# EAGLE design lcd-hedgehog (EAGLE 6.3)
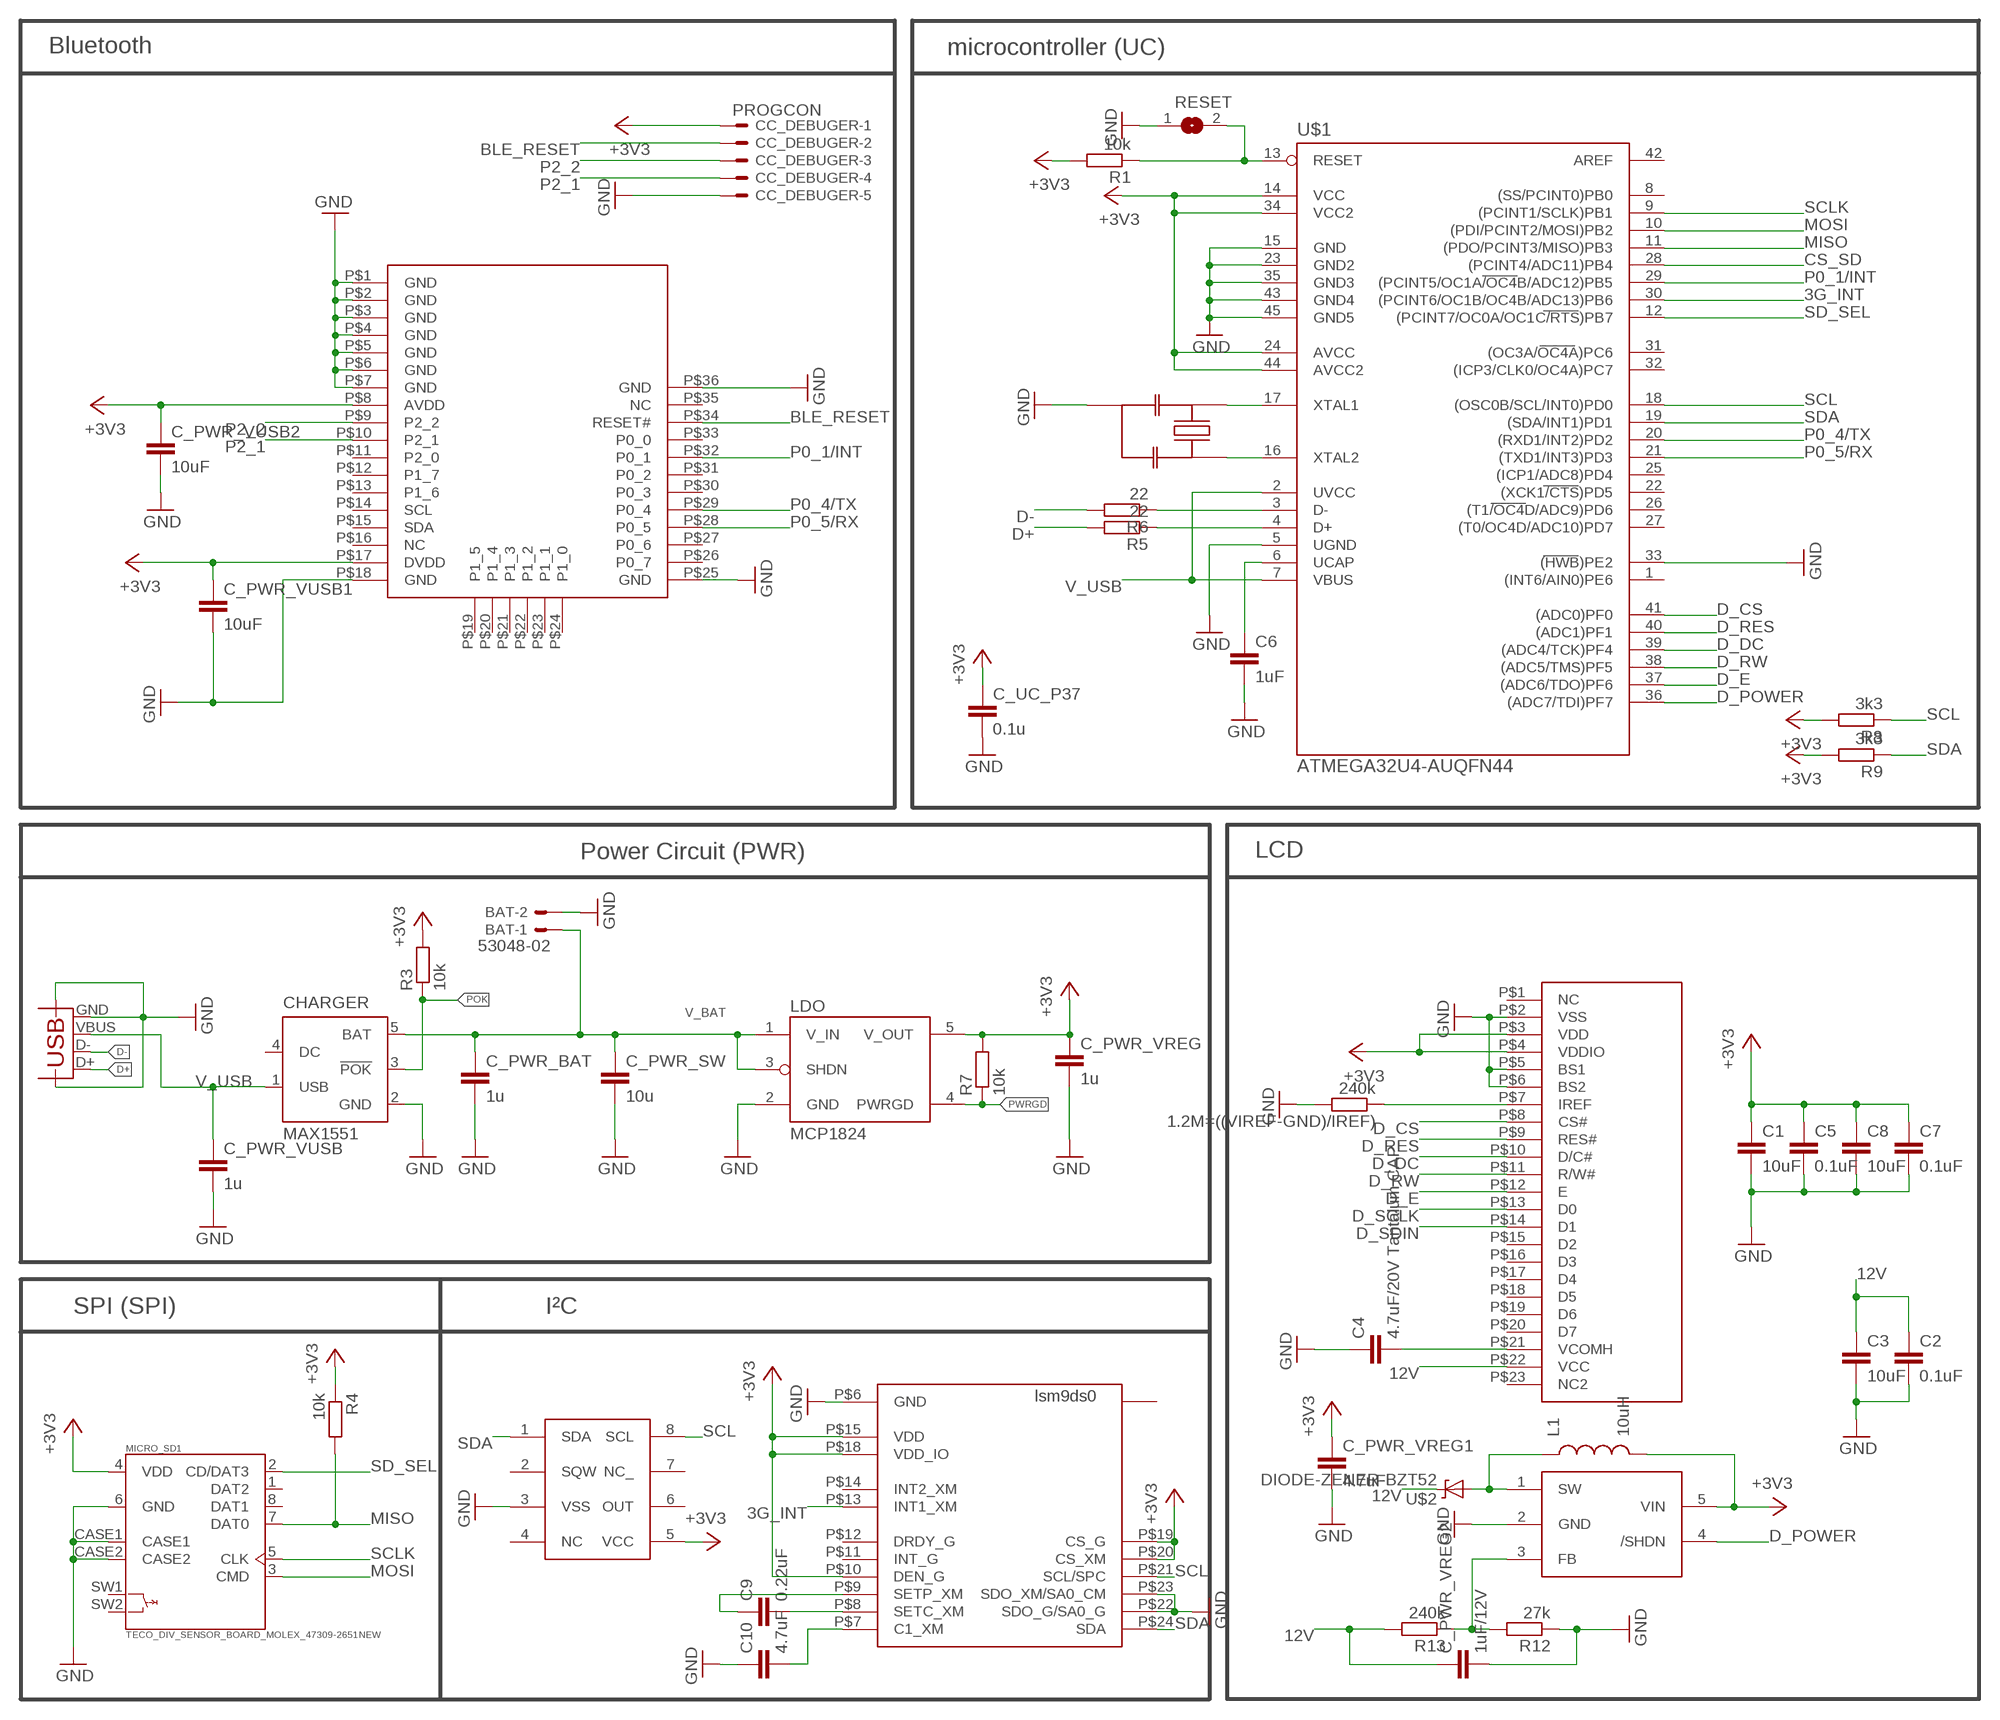
[diagram p0: schematic, sheet 1]

## Parts
1.2M=((VIREF-GND)/IREF)  240k  R-EU_R0603  [R0603]
12MHZ_RESONATOR  RESONATORPRQC-S  [PRQC]
BAT  53048-02  [53048-02]
C1  10uF  C-EUC0603K  [C0603K]
C2  0.1uF  C-EUC0603K  [C0603K]
C3  10uF  C-EUC0603K  [C0603K]
C4  4.7uF/20V Tantalum CAP  C-EUC0603K  [C0603K]
C5  0.1uF  C-EUC0603K  [C0603K]
C6  1uF  C-EUC0603K  [C0603K]
C7  0.1uF  C-EUC0603K  [C0603K]
C8  10uF  C-EUC0603K  [C0603K]
C9  0.22uF  C-EUC0603K  [C0603K]
C10  4.7uF  C-EUC0603K  [C0603K]
C_PWR_BAT  1u  C-EUC0603K  [C0603K]
C_PWR_SW  10u  C-EUC0805K  [C0805K]
C_PWR_VREG  1u  C-EUC0603K  [C0603K]
C_PWR_VREG1  4.7uF  C-EUC0603K  [C0603K]
C_PWR_VREG2  1uF/12V  C-EUC0603K  [C0603K]
C_PWR_VUSB  1u  C-EUC0603K  [C0603K]
C_PWR_VUSB1  10uF  C-EUC0603K  [C0603K]
C_PWR_VUSB2  10uF  C-EUC0603K  [C0603K]
C_UC_P37  0.1u  C-EUC0603K  [C0603K]
CC_DEBUGER  PROGCON  [53047-05-OCT]
CHARGER  MAX1551  [SOT23-5L]
L1  10uH  SPARKFUN_INDUCTOR0603  [SPARKFUN_0603]
LDO  MCP1824  [SOT-23-5]
MICRO_SD1  TECO_DIV_SENSOR_BOARD_MOLEX_47309-2651NEW  [TECO_DIV_SENSOR_BOARD_MOLEX_47309-2651]
R1  10k  R-EU_R0603  [R0603]
R3  10k  R-EU_R0603  [R0603]
R4  10k  R-EU_R0603  [R0603]
R5  22  R-EU_R0603  [R0603]
R6  22  R-EU_R0603  [R0603]
R7  10k  R-EU_R0603  [R0603]
R8  3k3  R-EU_R0603  [R0603]
R9  3k3  R-EU_R0603  [R0603]
R12  27k  R-EU_R0603  [R0603]
R13  240k  R-EU_R0603  [R0603]
RESET  SJ  [SJ]
U$1  ATMEGA32U4-AUQFN44  [QFN44]
U$2  DIODE-ZENER-BZT52  [SOD-323]
U$3  STUFF_M41T62  [STUFF_M41T62LC6F]
U$4  SFV23  [SFV23]
U$5  LM2703  [SOT-23-5]
U$6  BLE113-A  [BLE113-A]
U$7  LSM9D  [LGA4X4]
X1  SPARKFUN_USB-MICROB  [SPARKFUN_USB-MICROB]

## Nets
3G_INT: U$1.30((PCINT6/OC1B/OC4B/ADC13)PB6) U$7.P$13(INT1_XM)
12V: C2.1 C3.1 C_PWR_VREG2.1 R13.2 U$2.1(C) U$4.P$22(VCC)
+3V3: C1.1 C5.1 C7.1 C8.1 C_PWR_VREG1.1 C_PWR_VREG.1 C_PWR_VUSB1.1 C_PWR_VUSB2.1 C_UC_P37.1 CC_DEBUGER.1 L1.2 LDO.5(V_OUT) MICRO_SD1.4(VDD) R1.2 R3.2 R4.1 R7.2 R8.2 R9.2 U$1.14(VCC) U$1.24(AVCC) U$1.34(VCC2) U$1.44(AVCC2) U$3.5(VCC) U$4.P$3(VDD) U$4.P$4(VDDIO) U$5.5(VIN) U$6.P$8(AVDD) U$6.P$17(DVDD) U$7.P$10(DEN_G) U$7.P$15(VDD) U$7.P$18(VDD_IO) U$7.P$19(CS_G) U$7.P$20(CS_XM)
BLE_RESET: CC_DEBUGER.2 U$6.P$34(RESET#)
CS_SD: U$1.28((PCINT4/ADC11)PB4)
D+: R5.2 X1.D+
D-: R6.2 X1.D-
D_CS: U$1.41((ADC0)PF0) U$4.P$8(CS#)
D_DC: U$1.39((ADC4/TCK)PF4) U$4.P$10(D/C#)
D_E: U$1.37((ADC6/TDO)PF6) U$4.P$12(E)
D_POWER: U$1.36((ADC7/TDI)PF7) U$5.4(/SHDN)
D_RES: U$1.40((ADC1)PF1) U$4.P$9(RES#)
D_RW: U$1.38((ADC5/TMS)PF5) U$4.P$11(R/W#)
D_SCLK: U$4.P$13(D0)
D_SDIN: U$4.P$14(D1)
GND: 1.2M=((VIREF-GND)/IREF).2 12MHZ_RESONATOR.GND BAT.2 C1.2 C2.2 C3.2 C4.1 C5.2 C6.2 C7.2 C8.2 C10.1 C_PWR_BAT.2 C_PWR_SW.2 C_PWR_VREG1.2 C_PWR_VREG2.2 C_PWR_VREG.2 C_PWR_VUSB1.2 C_PWR_VUSB2.2 C_PWR_VUSB.2 C_UC_P37.2 CC_DEBUGER.5 CHARGER.2(GND) LDO.2(GND) MICRO_SD1.6(GND) MICRO_SD1.CASE1 MICRO_SD1.CASE2 R12.1 RESET.1 U$1.5(UGND) U$1.15(GND) U$1.23(GND2) U$1.33((HWB)PE2) U$1.35(GND3) U$1.43(GND4) U$1.45(GND5) U$3.3(VSS) U$4.P$2(VSS) U$4.P$5(BS1) U$4.P$6(BS2) U$5.2(GND) U$6.P$1(GND) U$6.P$2(GND) U$6.P$3(GND) U$6.P$4(GND) U$6.P$5(GND) U$6.P$6(GND) U$6.P$7(GND) U$6.P$18(GND) U$6.P$25(GND) U$6.P$36(GND) U$7.P$5(GND) U$7.P$22(SDO_G/SA0_G) U$7.P$23(SDO_XM/SA0_CM) X1.GND X1.GND@2(CASE) X1.GND@3(CASE)
MISO: MICRO_SD1.7(DAT0) R4.2 U$1.11((PDO/PCINT3/MISO)PB3)
MOSI: MICRO_SD1.3(CMD) U$1.10((PDI/PCINT2/MOSI)PB2)
N$1: R1.1 RESET.2 U$1.13(RESET)
N$2: 12MHZ_RESONATOR.2 U$1.17(XTAL1)
N$3: 12MHZ_RESONATOR.1 U$1.16(XTAL2)
N$5: R6.1 U$1.3(D-)
N$6: R5.1 U$1.4(D+)
N$7: C9.2 U$7.P$8(SETC_XM)
N$8: C9.1 U$7.P$9(SETP_XM)
N$9: C10.2 U$7.P$7(C1_XM)
N$11: C6.1 U$1.6(UCAP)
N$15: R12.2 R13.1 U$5.3(FB)
N$16: L1.1 U$2.2(A) U$5.1(SW)
N$22: C4.2 U$4.P$21(VCOMH)
N$23: 1.2M=((VIREF-GND)/IREF).1 U$4.P$7(IREF)
P0_1/INT: U$1.29((PCINT5/OC1A/OC4B/ADC12)PB5) U$6.P$32(P0_1)
P0_4/TX: U$1.20((RXD1/INT2)PD2) U$6.P$29(P0_4)
P0_5/RX: U$1.21((TXD1/INT3)PD3) U$6.P$28(P0_5)
P2_1: CC_DEBUGER.4 U$6.P$10(P2_1)
P2_2: CC_DEBUGER.3 U$6.P$9(P2_2)
POK: CHARGER.3(!POK) R3.1
PWRGD: LDO.4(PWRGD) R7.1
SCL: R8.1 U$1.18((OSC0B/SCL/INT0)PD0) U$3.8(SCL) U$7.P$21(SCL/SPC)
SCLK: MICRO_SD1.5(CLK) U$1.9((PCINT1/SCLK)PB1)
SD_SEL: MICRO_SD1.2(CD/DAT3) U$1.12((PCINT7/OC0A/OC1C/RTS)PB7)
SDA: R9.1 U$1.19((SDA/INT1)PD1) U$3.1(SDA) U$7.P$24(SDA)
V_BAT: BAT.1 C_PWR_BAT.1 C_PWR_SW.1 CHARGER.5(BAT) LDO.1(V_IN) LDO.3(SHDN)
V_USB: C_PWR_VUSB.1 CHARGER.1(USB) U$1.2(UVCC) U$1.7(VBUS) X1.VBUS
Unconnected: CHARGER.4(DC) MICRO_SD1.1(DAT2) MICRO_SD1.8(DAT1) MICRO_SD1.SW1 MICRO_SD1.SW2 U$1.1((INT6/AIN0)PE6) U$1.8((SS/PCINT0)PB0) U$1.22((XCK1/CTS)PD5) U$1.25((ICP1/ADC8)PD4) U$1.26((T1/OC4D/ADC9)PD6) U$1.27((T0/OC4D/ADC10)PD7) U$1.31((OC3A/OC4A)PC6) U$1.32((ICP3/CLK0/OC4A)PC7) U$1.42(AREF) U$3.2(SQW) U$3.4(NC) U$3.6(OUT) U$3.7(NC_) U$4.P$1(NC) U$4.P$15(D2) U$4.P$16(D3) U$4.P$17(D4) U$4.P$18(D5) U$4.P$19(D6) U$4.P$20(D7) U$4.P$23(NC2) U$6.P$11(P2_0) U$6.P$12(P1_7) U$6.P$13(P1_6) U$6.P$14(SCL) U$6.P$15(SDA) U$6.P$16(NC) U$6.P$19(P1_5) U$6.P$20(P1_4) U$6.P$21(P1_3) U$6.P$22(P1_2) U$6.P$23(P1_1) U$6.P$24(P1_0) U$6.P$26(P0_7) U$6.P$27(P0_6) U$6.P$30(P0_3) U$6.P$31(P0_2) U$6.P$33(P0_0) U$6.P$35(NC) U$7.P$1(RES) U$7.P$2(RES) U$7.P$3(RES) U$7.P$4(RES) U$7.P$6(GND) U$7.P$11(INT_G) U$7.P$12(DRDY_G) U$7.P$14(INT2_XM) U$7.P$16(VDD) U$7.P$17(VDD)

## Notes on the sheet
- Bluetooth | microcontroller (UC)
- Power Circuit (PWR) | LCD
- SPI (SPI) | I²C

## Library data of the parts
1.2M=((VIREF-GND)/IREF) R1 R3-R9 R12 R13 = rcl:R-EU_: RESISTOR, European symbol
12MHZ_RESONATOR = jnode:RESONATOR: Ceramic Resonator with caps AWSCR-16.00CV-T: 16Mhz ceramic resonator with 22pF capacitors PRQC16.00SR5010X000: 16Mhz ceramic resonator with 10pF capacitors; DIGIKEY: http://www.digikey.com/product-detail/en/PRQC12.00CR5010X000/478-6318-1-ND/2506334
BAT = con-molex:53?-02: CONNECTOR wire to board 1.25 mm (.049 inch) pitch header; MF: MOLEX; MPN: 53048-0210; OC_FARNELL: 1012259; OC_NEWARK: 57H4718
C1-C10 C_PWR_BAT C_PWR_SW C_PWR_VREG C_PWR_VREG1 C_PWR_VREG2 C_PWR_VUSB C_PWR_VUSB1 C_PWR_VUSB2 C_UC_P37 = rcl:C-EU: CAPACITOR, European symbol
CC_DEBUGER = HedgehogLib:PROGCON: Programmer Connector wire to board 1.25 mm (.049 inch) pitch header
CHARGER = maxim:MAX1551: Dual-Input USB/AC Adapter 1-Cell Li+ Battery Chargers Source: http://www.maxim-ic.com .. MAX1551-MAX1555.pdf; MF: MAXIM; MPN: MAX1551EZK-T; OC_FARNELL: 1628221; OC_NEWARK: 88H0599
L1 = jnode:SPARKFUN_INDUCTOR: Inductors Basic Inductor/Choke - 0603 and 1206. Footprints are not proven and vary greatly between part numbers.
LDO = HedgehogLib:MCP1824: MCP1824T-3302E/OT http://de.farnell.com/1578387
MICRO_SD1 = jnode_v32:TECO_DIV_SENSOR_BOARD_MOLEX_47309-2651
RESET = jumper:SJ: SMD solder JUMPER
U$1 = jnode:ATMEGA32U4-AU
U$2 = SparkFun-DiscreteSemi:DIODE-ZENER: Zener Diode Production Part - 8199 3.4V Zener Voltage
U$3 = lighter:STUFF_M41T62
U$4 = HedgehogLib:SFV23
U$5 = HedgehogLib:LM2703
U$6 = jnode:BLE113-A
U$7 = jnode:LSM9D
X1 = jnode_v32:SPARKFUN_USB: USB Connectors USB-B-PTH is fully proven SKU : PRT-00139 USB-miniB is fully proven SKU : PRT-00587 USB-A-PCB is untested. USB-A-H is throughly reviewed, but untested. Spark Fun Electronics SKU : PRT-00437 USB-B-SMT is throughly reviewed, but untested. Needs silkscreen touching up. USB-A-S has not been used/tested USB-MB-H has not been used/tested

## Board
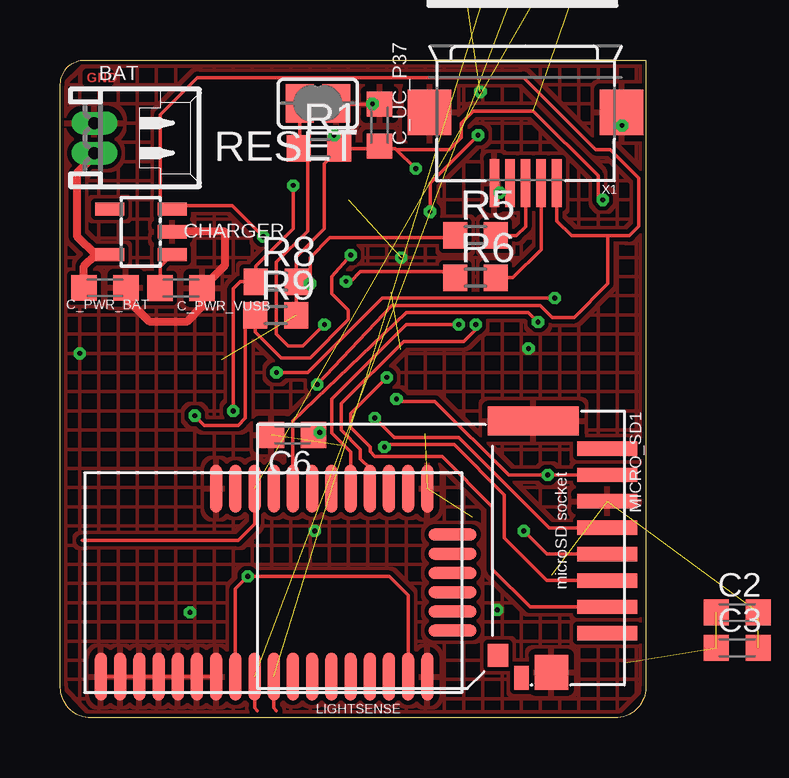
[diagram p1: board, top side]
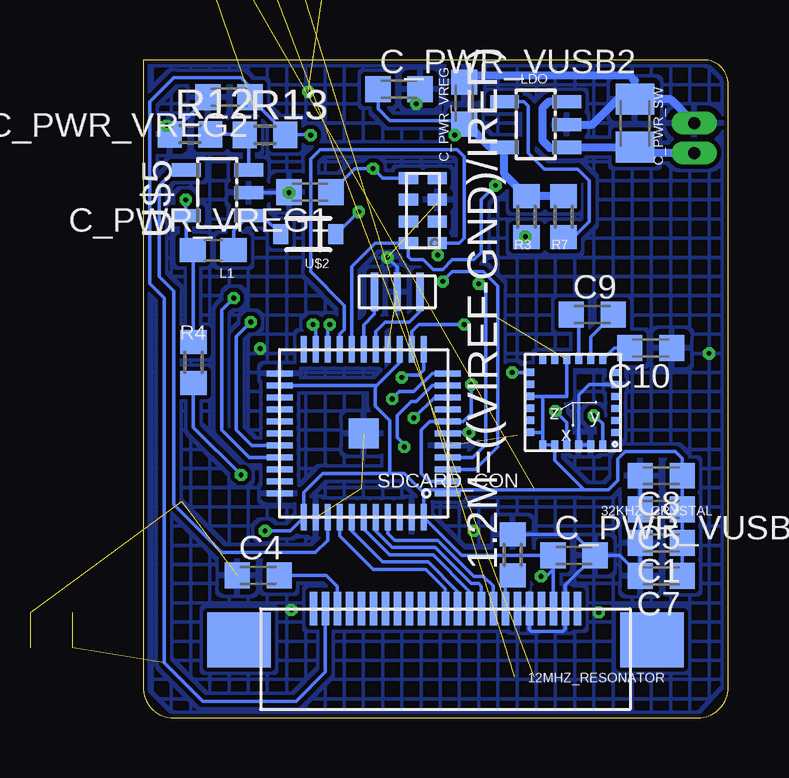
[diagram p2: board, bottom side, seen from below]

Size 24.38 x 27.43 mm. Coordinates in mm from the lower left corner, seen from the top.
Outline: 1.27,0 arc-90 0,1.27 0,26.42 arc-90 1.02,27.43 24.38,27.43 24.38,1.27 arc-90 23.11,0 1.27,0
Copper layers (1*16): Top 0.035mm / dielectric 1.5mm / Bottom 0.035mm
Design rules "default": minimum track width 6mil, minimum drill 12mil, track to track 7mil, track to pad 7mil, pad to pad 7mil, via to via 7mil, smd to smd 7mil, copper to edge 6mil, drill to drill 6mil, minimum pad ring 9mil, minimum via ring 6mil, stop-mask expansion 4mil, vias tented up to drill 0mil, thermal gap 10mil

### Footprints (pad centres in the part's own frame; a part is rotated, then mirrored left to right if it is on the bottom)
R0603 = smd 1 x 1.1: 1 -0.85,0; 2 0.85,0
PRQC = smd 0.3 x 1.6: 1 -0.95,0; 2 0.95,0; GND 0,0
53048-02 = drill 0.5 pad 0.698 long: 1 0.625,-1.25; 2 -0.625,-1.25
C0603K = smd 1.05 x 1.08: 1 -0.875,0; 2 0.875,0
C0805K = smd 1.3 x 1.6: 1 -1,0; 2 1,0
53047-05-OCT = drill 0.5 pad 0.889 octagon: 1 2.5,0; 2 1.25,0; 3 0,0; 4 -1.25,0; 5 -2.5,0
SOT23-5L = smd 0.55 x 1.2: 1 -0.95,-1.3; 2 0,-1.3; 3 0.95,-1.3; 4 0.95,1.3; 5 -0.95,1.3
SPARKFUN_0603 = smd 1.1 x 1: 1 -0.85,0; 2 0.85,0
SOT-23-5 = smd 0.55 x 1.2: 1 -0.95,-1.3; 2 0,-1.3; 3 0.95,-1.3; 4 0.95,1.3; 5 -0.95,1.3
TECO_DIV_SENSOR_BOARD_MOLEX_47309-2651 = smd 0.6 x 2.5: 1 3.43,2.385; 2 2.33,2.385; 3 1.23,2.385; 4 0.13,2.385; 5 -0.97,2.385; 6 -2.07,2.385; 7 -3.17,2.385; 8 -4.27,2.385 | smd 1.2 x 3.79: CASE1 -5.42,-0.695 | smd 1.45 x 1.4: CASE2 5.055,0.06 | smd 1 x 0.6: SW1 5.28,-1.19 | smd 0.95 x 0.85: SW2 4.355,-2.165
SJ = smd 1.168 x 1.6: 1 -0.762,0; 2 0.762,0
QFN44 = smd 1.1 x 0.25: 1 -3.5,2.5; 2 -3.5,2; 3 -3.5,1.5; 4 -3.5,1; 5 -3.5,0.5; 6 -3.5,0; 7 -3.5,-0.5; 8 -3.5,-1; 9 -3.5,-1.5; 10 -3.5,-2; 11 -3.5,-2.5; 23 3.5,-2.5; 24 3.5,-2; 25 3.5,-1.5; 26 3.5,-1; 27 3.5,-0.5; 28 3.5,0; 29 3.5,0.5; 30 3.5,1; 31 3.5,1.5; 32 3.5,2; 33 3.5,2.5 | smd 0.25 x 1.1: 12 -2.5,-3.5; 13 -2,-3.5; 14 -1.5,-3.5; 15 -1,-3.5; 16 -0.5,-3.5; 17 0,-3.5; 18 0.5,-3.5; 19 1,-3.5; 20 1.5,-3.5; 21 2,-3.5; 22 2.5,-3.5; 34 2.5,3.5; 35 2,3.5; 36 1.5,3.5; 37 1,3.5; 38 0.5,3.5; 39 0,3.5; 40 -0.5,3.5; 41 -1,3.5; 42 -1.5,3.5; 43 -2,3.5; 44 -2.5,3.5 | smd 1.25 x 1.25: 45 0,0
SOD-323 = smd 0.63 x 0.83: 1 -1.15,0; 2 1.15,0
STUFF_M41T62LC6F = smd 0.5 x 0.8: 1 -0.9,-0.6; 2 0,-0.6; 3 0.9,-0.6; 4 1.8,-0.6; 5 1.8,0.6; 6 0.9,0.6; 7 0,0.6; 8 -0.9,0.6
SFV23 = smd 0.3 x 1.4: P$1 5.5,1; P$2 5,1; P$3 4.5,1; P$4 4,1; P$5 3.5,1; P$6 3,1; P$7 2.5,1; P$8 2,1; P$9 1.5,1; P$10 1,1; P$11 0.5,1; P$12 0,1; P$13 -0.5,1; P$14 -1,1; P$15 -1.5,1; P$16 -2,1; P$17 -2.5,1; P$18 -3,1; P$19 -3.5,1; P$20 -4,1; P$21 -4.5,1; P$22 -5,1; P$23 -5.5,1 | smd 2.65 x 2.3: P$24 -8.6,-0.3; P$25 8.6,-0.3
BLE113-A = smd 2 x 0.5: P$1 0.65,15.05; P$2 0.65,14.25; P$3 0.65,13.45; P$4 0.65,12.65; P$5 0.65,11.85; P$6 0.65,11.05; P$7 0.65,10.25; P$8 0.65,9.45; P$9 0.65,8.65; P$10 0.65,7.85; P$11 0.65,7.05; P$12 0.65,6.25; P$13 0.65,5.45; P$14 0.65,4.65; P$15 0.65,3.85; P$16 0.65,3.05; P$17 0.65,2.25; P$18 0.65,1.45; P$25 8.5,1.45; P$26 8.5,2.25; P$27 8.5,3.05; P$28 8.5,3.85; P$29 8.5,4.65; P$30 8.5,5.45; P$31 8.5,6.25; P$32 8.5,7.05; P$33 8.5,7.85; P$34 8.5,8.65; P$35 8.5,9.45; P$36 8.5,10.25 | smd 0.5 x 2: P$19 2.575,0.4; P$20 3.375,0.4; P$21 4.175,0.4; P$22 4.975,0.4; P$23 5.775,0.4; P$24 6.575,0.4
LGA4X4 = smd 0.35 x 0.3: P$1 -1.775,1.255; P$2 -1.775,0.755; P$3 -1.775,0.255; P$4 -1.775,-0.245; P$5 -1.775,-0.745; P$6 -1.775,-1.245; P$13 1.775,-1.25; P$14 1.775,-0.75; P$15 1.775,-0.25; P$16 1.775,0.25; P$17 1.775,0.75; P$18 1.775,1.25 | smd 0.3 x 0.35: P$7 -1.25,-1.775; P$8 -0.75,-1.775; P$9 -0.25,-1.775; P$10 0.25,-1.775; P$11 0.75,-1.775; P$12 1.25,-1.775; P$19 1.25,1.775; P$20 0.75,1.775; P$21 0.25,1.775; P$22 -0.25,1.775; P$23 -0.75,1.775; P$24 -1.25,1.775
SPARKFUN_USB-MICROB = smd 0.4 x 2: D+ 0,3.1; D- -0.65,3.1; GND 1.3,3.1; ID 0.65,3.1; VBUS -1.3,3.1 | smd 1.8 x 1.9: GND@2 -4,0.15; GND@3 4,0.15

### Placement (x,y rotation side)
1.2M=((VIREF-GND)/IREF)  8.98,6.8 90 bottom
12MHZ_RESONATOR  13.79,17.76 180 bottom
BAT  2.67,24.18 270 top
C1  2.79,7.3 180 bottom
C2  28.19,4.39 0 top
C3  28.19,2.92 0 top
C4  19.58,5.94 0 bottom
C5  2.79,8.7 180 bottom
C6  9.67,11.8 180 top
C7  2.79,5.92 180 bottom
C8  2.79,10.1 180 bottom
C9  5.66,16.81 0 bottom
C10  3.23,15.42 180 bottom
C_PWR_BAT  1.85,17.93 0 top
C_PWR_SW  3.89,24.79 90 bottom
C_PWR_VREG  11,25.63 90 bottom
C_PWR_VREG1  17.42,21.92 180 bottom
C_PWR_VREG2  20.8,25.88 180 bottom
C_PWR_VUSB  5.02,17.93 0 top
C_PWR_VUSB1  6.42,6.78 0 bottom
C_PWR_VUSB2  13.72,26.21 0 bottom
C_UC_P37  13.29,24.71 90 top
CC_DEBUGER  19.25,31.21 0 top  (outside the outline)
CHARGER  3.35,20.27 90 top
L1  21.46,19.51 180 bottom
LDO  8.03,24.74 90 bottom
MICRO_SD1  20.4,6.96 270 top
R1  10.78,23.74 0 top
R3  8.41,20.9 90 bottom
R4  22.28,14.82 270 bottom
R5  17.3,20.13 0 top
R6  17.3,18.35 0 top
R7  6.86,20.9 90 bottom
R8  8.99,18.19 0 top
R9  8.97,16.79 0 top
R12  22.43,24.33 0 bottom
R13  19.3,24.31 0 bottom
RESET  10.73,25.62 180 top
U$1  15.19,11.86 180 bottom
U$2  17.5,20.17 180 bottom
U$3  12.73,20.7 90 bottom
U$4  11.79,3.56 0 bottom
U$5  21.29,21.89 90 bottom
U$6  16.74,1.07 90 top
U$7  6.48,13.16 180 bottom
X1  19.38,25.4 180 top

### Tracks (layer width: path | path; a pad name or v marks a point on that pad's centre or on a via)
3G_INT  (via drill 0.2)
  Top 0.15: v20.6,17.5 13.4,17.5 10.3,14.4 v9,14.4
  Bottom 0.15: U$1.30 19.96,10.86 21.1,12 21.1,17 v20.6,17.5 | v9,14.4 U$7.P$13
12V  (via drill 0.2)  (2 unrouted)
  Top 0.15: v17.4,24.3 15.4,22.3 v15.4,21.1
  Bottom 0.15: v17.4,24.3 v17.41,24.31 R13.2 18.45,24.41 C_PWR_VREG2.1 19.93,26.33 20.3,26.7 23.1,26.7 24.1,25.7 24.1,18.1 23.5,17.5 23.5,2.3 21.9,0.7 18,0.7 16.79,1.91 U$4.P$22 | v15.4,21.1 16.33,20.17 U$2.1
+3V3  (via drill 0.2)  (2 unrouted)
  Top 0.15: C_UC_P37.1 13.2,23.74 | 13.2,23.74 R1.2 | R8.2 9.82,18.19 | 9.82,18.19 R9.2 | R1.2 11.63,24.07 v11.4,24.3 | 13.2,23.74 13.96,23.74 14,23.7 | 14,23.7 v14.8,22.9 | 9.82,18.19 9.82,19.22 11,20.4 11,23.12 R1.2 | v22.6,21.6 22.4,21.6 22.4,22.6 19.7,25.3 17.2,25.3 16.7,24.8 16.7,24.2 16.2,23.7 14,23.7 | U$6.P$17 14.49,5.11 13.7,5.9 v7.8,5.9 7.29,5.39 U$6.P$8 | MICRO_SD1.4 20.27,6.83 v19.3,7.8
  Bottom 0.15: U$7.P$18 7.73,11.91 | 7.73,11.91 U$7.P$19 U$7.P$20 7.23,10.73 6,9.5 | U$7.P$15 7.73,13.41 | 7.73,13.41 7.73,11.91 | U$7.P$10 6.73,13.41 7.73,13.41 | U$1.44 11.11,6.78 C_PWR_VUSB1.1 7.29,6.76 7.29,6.2 | U$4.P$4 U$4.P$3 7.29,6.2 | C7.1 C1.1 C5.1 C8.1 1.92,10.82 2.2,11.1 4.3,11.1 4.6,10.8 4.6,9.9 5,9.5 6,9.5 | U$1.14 13.69,14.81 14.64,13.86 14.7,13.86 | 14.7,13.86 U$1.24 | U$1.44 12.69,9.39 13.5,10.2 14.1,10.2 | 14.1,10.2 16.9,10.2 17.69,9.41 U$1.34 18.25,7.8 v19.3,7.8 | 6,9.5 12.69,9.5 U$1.44 | 14.1,10.2 14.1,12.4 14.7,13 14.7,13.86 | v11.4,24.3 11.4,24.35 C_PWR_VREG.1 11.14,24.9 14.1,24.9 14.59,25.39 C_PWR_VUSB2.1 | U$3.5 14.4,22.5 v14.8,22.9 15.57,22.9 C_PWR_VREG1.1 | R4.1 22.28,19.48 L1.2 22.59,19.78 U$5.5 22.6,20.96 v22.6,21.6 | v7.8,5.9 7.59,5.9 7.29,6.2
  Bottom 0.33: C_PWR_VREG.1 10.88,24.75 9.93,23.8 9.68,23.79 LDO.5 9.33,22.67 R3.2 R7.2
BLE_RESET  (1 unrouted)
  Top 0.15: U$6.P$34 8.09,8.09 7.4,7.4 0.9,7.4
D+
  Top 0.15: X1.D+ 19.38,20.48 19,20.1 18.17,20.1 R5.2
D-
  Top 0.15: X1.D- 20.03,19.53 18.85,18.35 R6.2
D_CS
  Bottom 0.15: U$1.41 14.19,7.69 13.9,7.4 12.1,7.4 10.6,5.9 10.2,5.9 9.8,5.5 U$4.P$8
D_DC
  Bottom 0.15: U$4.P$10 10.79,5.29 12.3,6.8 14.1,6.8 15.19,7.89 U$1.39
D_E
  Bottom 0.15: U$1.37 16.19,7.59 14.8,6.2 12.6,6.2 11.79,5.39 U$4.P$12
D_POWER
  Bottom 0.15: U$1.36 16.69,7.41 17.2,6.9 21.1,6.9 23.1,8.9 23.1,17.8 23.7,18.4 23.7,22.2 23.05,22.84 U$5.4
D_RES
  Bottom 0.15: U$4.P$9 10.29,5.49 10.4,5.6 10.7,5.6 12.2,7.1 14,7.1 14.69,7.79 U$1.40
D_RW
  Bottom 0.15: U$1.38 15.69,7.79 14.4,6.5 12.5,6.5 11.29,5.29 U$4.P$11
GND  (via drill 0.2)  (9 unrouted)
  Top 0.15: RESET.1 11.53,25.58 C_UC_P37.2 | U$6.P$7 U$6.P$6 U$6.P$5 U$6.P$4 U$6.P$3 U$6.P$2 U$6.P$1 | 23.28,25.15 X1.GND@2 23.38,24.72 v23.4,24.7 | v18.3,21.9 18.08,22.12 X1.GND | v14.2,19.2 14.3,19.2
  Top 0.33: CHARGER.2 6.86,20.27 6.86,18.89 C_PWR_VUSB.2 5.92,18.03 5.92,17.17 5.28,16.53 3.71,16.53 2.73,17.51 C_PWR_BAT.2
  Bottom 0.15: U$4.P$6 U$4.P$5 8.29,3.69 8.2,3.6 6.9,3.6 6.79,3.71 U$4.P$2 6.79,5.54 C_PWR_VUSB1.2 | C_PWR_VREG2.2 23.23,24.33 R12.1 23.4,24.45 v23.4,24.7 | C_PWR_VREG1.2 18.32,21.89 U$5.2 | C8.2 C5.2 C1.2 C7.2 4.53,6.78 C_PWR_VUSB1.2 | 1.2M=((VIREF-GND)/IREF).2 6.42,7.64 C_PWR_VUSB1.2 | U$7.P$23 U$7.P$22 6.23,13.47 5.8,13.9 U$7.P$5 | C_PWR_VUSB2.2 12.83,26.2 12.8,26.2 13,26 v13,25.6 | 12MHZ_RESONATOR.GND 13.79,18.79 v14.2,19.2 | U$3.3 12,21.6
  Bottom 0.33: 3.9,26.09 C_PWR_SW.2 | C_PWR_SW.2 3.77,26.01 | BAT.2 2.4,25.79 C_PWR_SW.2 | C_PWR_VREG.2 11.12,26.58 11.33,26.78 | LDO.2 5.66,24.74 4.62,25.78 3.62,25.78 C_PWR_SW.2 | 11,26.57 C_PWR_VREG.2 | C_PWR_SW.2 3.89,26.57 4.09,26.77 10.73,26.77 C_PWR_VREG.2
  other vias: 5.4,4.4 10.6,7.8 0.8,15.2 19.5,15.4 17.5,26.1 18.2,4.5
  pour Top (hatched): 0.1,1.3 1.2,0.1 23.2,0.1 24.2,1.1 24.2,27.2 0.9,27.2 0.1,26.4
  pour Bottom (hatched): 0.1,1.4 1.2,0.2 23.2,0.2 24.2,1.2 24.2,27.3 0.9,27.3 0.1,26.5
MISO  (via drill 0.2)
  Top 0.15: MICRO_SD1.7 v20.3,10.13 18.67,10.13 15.6,13.2 14.1,13.2 v14,13.3
  Bottom 0.15: v14,13.3 13.7,13.6 13.1,13.6 12.34,14.36 U$1.11 | R4.2 22.28,12.11 v20.3,10.13
MOSI  (via drill 0.2)
  Top 0.15: MICRO_SD1.3 20.27,5.73 18.5,7.5 18.5,9.3 16.4,11.4 13.6,11.4 v13.5,11.3
  Bottom 0.15: v13.5,11.3 13.5,11.4 13.8,11.7 13.8,12.6 13.2,13.2 13,13.2 12.34,13.86 U$1.10
N$1  (via drill 0.2)
  Top 0.15: RESET.2 9.96,23.78 R1.1 10.3,23.37 10.3,20.3 9,19 9,16 9.5,15.5 10.1,15.5 v11,16.4
  Bottom 0.15: v11,16.4 12.9,16.4 13.19,16.11 U$1.13
N$2
  Bottom 0.15: 12MHZ_RESONATOR.2 14.74,16.84 15.19,16.39 U$1.17
N$3
  Bottom 0.15: U$1.16 14.69,16.11 14.3,16.5 13.3,16.5 12.84,16.96 12MHZ_RESONATOR.1
N$5  (via drill 0.2)
  Top 0.15: v11.9,18.2 12.1,18.2 12.5,18.6 15.9,18.6 R6.1
  Bottom 0.15: U$1.3 10.54,10.36 9.6,11.3 9.6,18 10.2,18.6 11.5,18.6 v11.9,18.2
N$6  (via drill 0.2)
  Top 0.15: v10.4,18.1 10.4,19.2 11.23,20.03 16.15,20.03 R5.1
  Bottom 0.15: U$1.4 10.64,10.86 10.1,11.4 10.1,17.8 v10.4,18.1
N$7
  Bottom 0.15: U$7.P$8 5.73,15.88 C9.2
N$8
  Bottom 0.15: U$7.P$9 6.23,16.82 C9.1
N$9
  Bottom 0.15: U$7.P$7 4.74,15.42 C10.2
N$11  (via drill 0.2)
  Top 0.15: C6.1 10.7,11.8 v10.8,11.9
  Bottom 0.15: v10.8,11.9 11.65,11.9 U$1.6
N$15
  Bottom 0.15: U$5.3 19.98,24.14 R13.1 20.18,24.33 R12.2
N$16
  Bottom 0.15: L1.1 20.61,20.32 U$5.1 19.43,20.95 U$2.2
N$22
  Bottom 0.15: U$4.P$21 16.29,5.49 16.74,5.94 C4.2
N$23
  Bottom 0.15: U$4.P$7 9.29,5.64 1.2M=((VIREF-GND)/IREF).1
P0_1/INT  (via drill 0.2)
  Top 0.15: U$6.P$32 9.69,12.39 14.4,16.9 19.5,16.9 v19.9,16.5
  Bottom 0.15: v19.9,16.5 20.5,15.9 20.5,12 19.86,11.36 U$1.29
P0_4/TX  (via drill 0.2)
  Top 0.15: U$6.P$29 12.09,11.09 11.3,11.88 11.3,13.3 14.4,16.4 v16.6,16.4 16.6,16.3
  Bottom 0.15: v16.6,16.4 16.69,16.29 U$1.20
P0_5/RX  (via drill 0.2)
  Top 0.15: U$6.P$28 12.89,10.41 12.5,10.8 12.5,11.2 11.7,12 11.7,13.1 14.3,15.7 16.8,15.7 17.3,16.2 v17.3,16.4
  Bottom 0.15: v17.3,16.4 17.19,16.29 U$1.21
P2_1  (1 unrouted)
  Top 0.15: U$6.P$10 8.89,0.41 9,0.3
P2_2  (1 unrouted)
  Top 0.15: U$6.P$9 8.09,0.41 8.2,0.3
POK  (via drill 0.2)
  Top 0.15: 4.74,21.36 7.15,21.36 v8.45,20.06
  Top 0.203: CHARGER.3 4.74,21.36
  Bottom 0.15: R3.1 v8.45,20.06
PWRGD
  Bottom 0.15: LDO.4 8.52,25.69 8.33,25.5 8.33,23.55 7.67,22.89 6.27,22.89 5.79,22.4 5.79,20.7 6.44,20.05
  Bottom 0.203: 6.44,20.05 R7.1
SCL  (via drill 0.2)
  Top 0.15: v7.2,12.8 7.2,17.9 7.49,18.19 R8.1 8.14,18.84 9.7,20.4 v9.7,22.2
  Bottom 0.15: U$7.P$21 6.73,12.33 v7.2,12.8 | v9.7,22.2 10.3,21.6 10.3,19.4 10.6,19.1 11.5,19.1 11.9,18.7 12.3,18.7 12.7,19.1 13.2,19.1 13.32,19.23 U$3.8 14.7,19.8 15.69,18.81 U$1.18
SCLK  (via drill 0.2)
  Top 0.15: MICRO_SD1.5 20.37,7.93 16.6,11.7 13.9,11.7 v13.1,12.5
  Bottom 0.15: U$1.9 12.24,13.36 v13.1,12.5
SD_SEL  (via drill 0.2)
  Top 0.15: v13.6,14.2 12.1,12.7 12.1,12.1 12.9,11.3 12.9,11.1 13.1,10.9 15.9,10.9 18,8.8 18,6.2 19.57,4.63 MICRO_SD1.2
  Bottom 0.15: U$1.12 12.69,14.51 12.9,14.3 13.5,14.3 v13.6,14.2
SDA  (via drill 0.2)
  Top 0.15: v12.1,19.3 11.3,18.4 11.3,17.7 12,17 12,16.6 10.4,15 9.2,15 8.12,16.08 R9.1 7.7,16.37 7.7,12.5 7.4,12.2 6,12.2 v5.6,12.6
  Bottom 0.15: U$1.19 16.19,16.01 16,16.2 16,17.2 17.4,18.6 17.4,23.3 17,23.7 11.3,23.7 11,23.4 11,20 11.2,19.8 U$3.1 12.1,19.78 v12.1,19.3 | v5.6,12.6 5.23,12.27 U$7.P$24
V_BAT
  Top 0.33: BAT.1 1.42,23.45 0.69,22.71 0.69,20.1 1.46,19.32 | C_PWR_BAT.1 0.98,18.84 1.46,19.32 | 1.46,19.32 CHARGER.5
  Bottom 0.33: 3.83,24.07 C_PWR_SW.1 | LDO.3 7.48,25.69 7.75,25.43 7.75,24.08 7.44,23.77 6.74,23.77 LDO.1 3.61,23.79 C_PWR_SW.1 | BAT.1 3.65,23.56 arc90 C_PWR_SW.1
V_USB  (via drill 0.2)
  Top 0.15: CHARGER.1 4.15,18.82 C_PWR_VUSB.1 4.15,25.15 5.7,26.7 19.3,26.7 22.3,23.7 22.9,23.7 24.1,22.5 24.1,20.5 23.7,20.1 22.8,20.1 | 22.8,20.1 21.3,20.1 20.68,20.72 X1.VBUS | v10.7,13.9 13.8,17.2 20,17.2 20.5,16.7 21.4,16.7 22.8,18.1 22.8,20.1
  Bottom 0.15: U$1.2 12.46,9.86 12.8,10.2 12.8,12 12.44,12.36 U$1.7 11.04,12.36 10.7,12.7 v10.7,13.9

### Text on the board
Top: GND
tNames: LIGHTSENSE
bNames: SDCARD_CON | 32KHZ_CRYSTAL | 12MHZ_RESONATOR